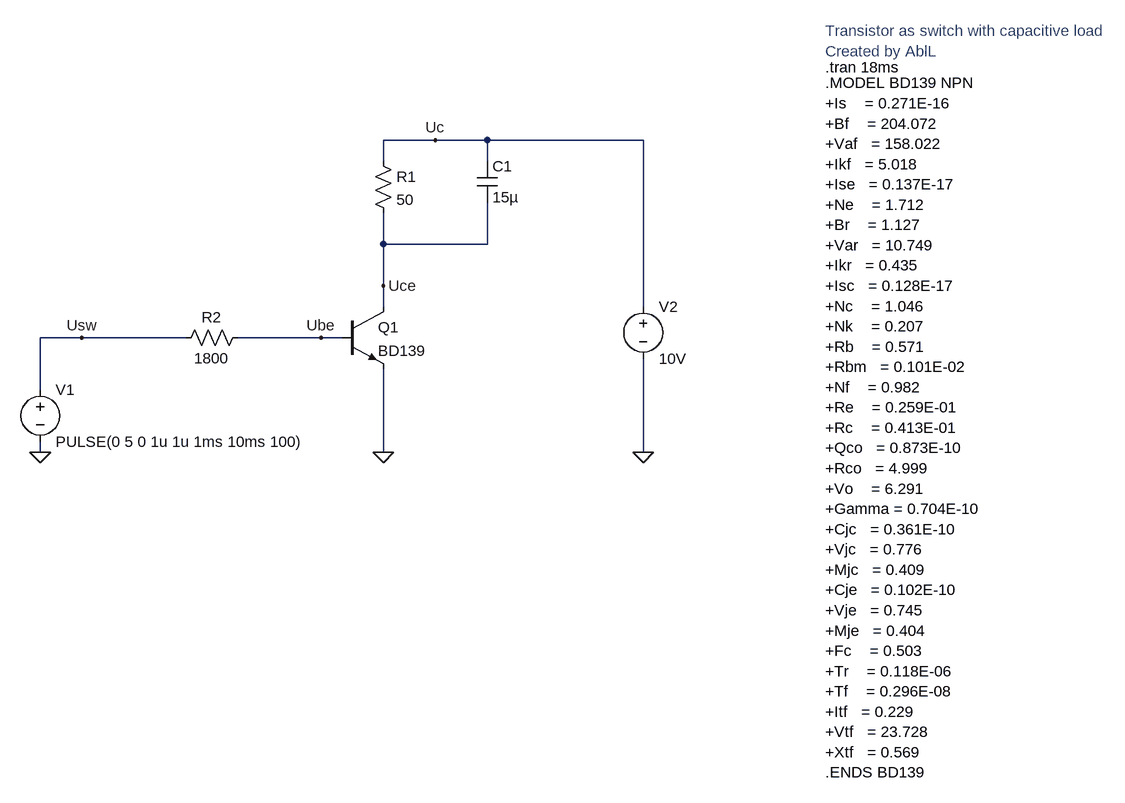
[diagram p0: schematic Transistor_Schalter_mit_kap_Last.asc]
Transistor_Schalter_mit_kap_Last.asc, the LTspice schematic file:
Version 4
SHEET 1 1324 880
WIRE 240 0 160 0
WIRE 320 0 240 0
WIRE 560 0 320 0
WIRE 160 32 160 0
WIRE 320 32 320 0
WIRE 160 160 160 112
WIRE 320 160 320 96
WIRE 320 160 160 160
WIRE 160 224 160 160
WIRE 160 256 160 224
WIRE 560 256 560 0
WIRE -304 304 -368 304
WIRE -144 304 -304 304
WIRE 64 304 -64 304
WIRE 96 304 64 304
WIRE -368 384 -368 304
WIRE -368 480 -368 464
WIRE 160 480 160 352
WIRE 560 480 560 336
FLAG -368 480 0
FLAG 160 480 0
FLAG 560 480 0
FLAG 160 224 Uce
FLAG 64 304 Ube
FLAG -304 304 Usw
FLAG 240 0 Uc
SYMBOL res 144 16 R0
SYMATTR InstName R1
SYMATTR Value 50
SYMBOL cap 304 32 R0
SYMATTR InstName C1
SYMATTR Value 15µ
SYMBOL res -48 288 R90
WINDOW 0 0 56 VBottom 2
WINDOW 3 32 56 VTop 2
SYMATTR InstName R2
SYMATTR Value 1800
SYMBOL voltage -368 368 R0
SYMATTR InstName V1
SYMATTR Value PULSE(0 5 0 1u 1u 1ms 10ms 100)
SYMBOL voltage 560 240 R0
WINDOW 123 0 0 Left 0
WINDOW 39 0 0 Left 0
SYMATTR InstName V2
SYMATTR Value 10V
SYMBOL npn 96 256 R0
SYMATTR InstName Q1
SYMATTR Value BD139
TEXT 840 -88 Left 2 !.MODEL BD139 NPN\n+Is    = 0.271E-16\n+Bf    = 204.072\n+Vaf   = 158.022\n+Ikf   = 5.018\n+Ise   = 0.137E-17\n+Ne    = 1.712\n+Br    = 1.127\n+Var   = 10.749\n+Ikr   = 0.435\n+Isc   = 0.128E-17\n+Nc    = 1.046\n+Nk    = 0.207\n+Rb    = 0.571\n+Rbm   = 0.101E-02\n+Nf    = 0.982\n+Re    = 0.259E-01\n+Rc    = 0.413E-01\n+Qco   = 0.873E-10\n+Rco   = 4.999\n+Vo    = 6.291\n+Gamma = 0.704E-10\n+Cjc   = 0.361E-10\n+Vjc   = 0.776\n+Mjc   = 0.409\n+Cje   = 0.102E-10\n+Vje   = 0.745\n+Mje   = 0.404\n+Fc    = 0.503\n+Tr    = 0.118E-06\n+Tf    = 0.296E-08\n+Itf   = 0.229\n+Vtf   = 23.728\n+Xtf   = 0.569\n.ENDS BD139
TEXT 840 -168 Left 2 ;Transistor as switch with capacitive load\nCreated by AblL
TEXT 840 -112 Left 2 !.tran 18ms

The netlist it stands for:
* Transistor_Schalter_mit_kap_Last.asc
R1 Uc Uce 50
C1 Uc Uce 15µ
R2 Ube Usw 1800
V1 Usw 0 PULSE(0 5 0 1u 1u 1ms 10ms 100)
V2 Uc 0 10V
Q1 Uce Ube 0 0 BD139
.model NPN NPN
.model PNP PNP
.lib standard.bjt
.MODEL BD139 NPN
+Is    = 0.271E-16
+Bf    = 204.072
+Vaf   = 158.022
+Ikf   = 5.018
+Ise   = 0.137E-17
+Ne    = 1.712
+Br    = 1.127
+Var   = 10.749
+Ikr   = 0.435
+Isc   = 0.128E-17
+Nc    = 1.046
+Nk    = 0.207
+Rb    = 0.571
+Rbm   = 0.101E-02
+Nf    = 0.982
+Re    = 0.259E-01
+Rc    = 0.413E-01
+Qco   = 0.873E-10
+Rco   = 4.999
+Vo    = 6.291
+Gamma = 0.704E-10
+Cjc   = 0.361E-10
+Vjc   = 0.776
+Mjc   = 0.409
+Cje   = 0.102E-10
+Vje   = 0.745
+Mje   = 0.404
+Fc    = 0.503
+Tr    = 0.118E-06
+Tf    = 0.296E-08
+Itf   = 0.229
+Vtf   = 23.728
+Xtf   = 0.569
.ENDS BD139
* Transistor as switch with capacitive load
* Created by AblL
.tran 18ms
.backanno
.end